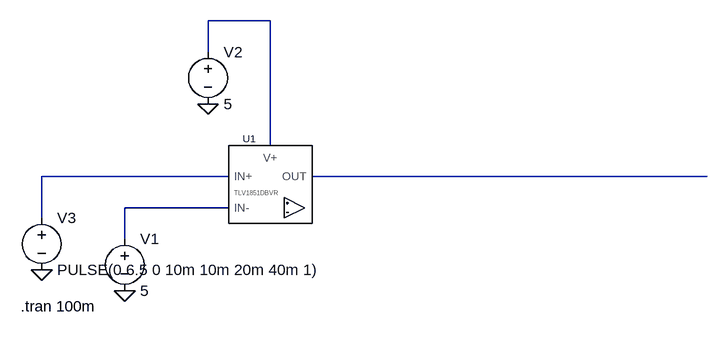
[diagram p0: schematic pulse voltage already in.asc]
pulse voltage already in.asc, the LTspice schematic file:
Version 4.1
SHEET 1 880 680
WIRE 192 -96 96 -96
WIRE 96 -48 96 -96
WIRE 192 96 192 -96
WIRE 128 144 -160 144
WIRE 864 144 256 144
WIRE 128 192 -32 192
WIRE -160 208 -160 144
WIRE -32 240 -32 192
FLAG 96 32 0
FLAG -32 320 0
FLAG -160 288 0
SYMBOL TLV1851DBVR 192 144 R0
SYMATTR InstName U1
SYMBOL voltage 96 -64 R0
WINDOW 123 0 0 Left 0
WINDOW 39 0 0 Left 0
SYMATTR InstName V2
SYMATTR Value 5
SYMBOL voltage -32 224 R0
WINDOW 123 0 0 Left 0
WINDOW 39 0 0 Left 0
SYMATTR InstName V1
SYMATTR Value 5
SYMBOL voltage -160 192 R0
WINDOW 123 0 0 Left 0
WINDOW 39 0 0 Left 0
SYMATTR InstName V3
SYMATTR Value PULSE(0 6.5 0 10m 10m 20m 40m 1)
TEXT -192 344 Left 2 !.tran 100m

The netlist it stands for:
* pulse voltage already in.asc
X§U1 N002 N004 N001 N003 TLV1851DBVR  ; pins IN+ IN- V+ OUT
V2 N001 0 5
V1 N004 0 5
V3 N002 0 PULSE(0 6.5 0 10m 10m 20m 40m 1)
.tran 100m
.lib TLV1851DBVR.sub
.backanno
.end